# Altium project MSXIV_Front_Power_Distribution.PrjPcb (part 1 of 4)
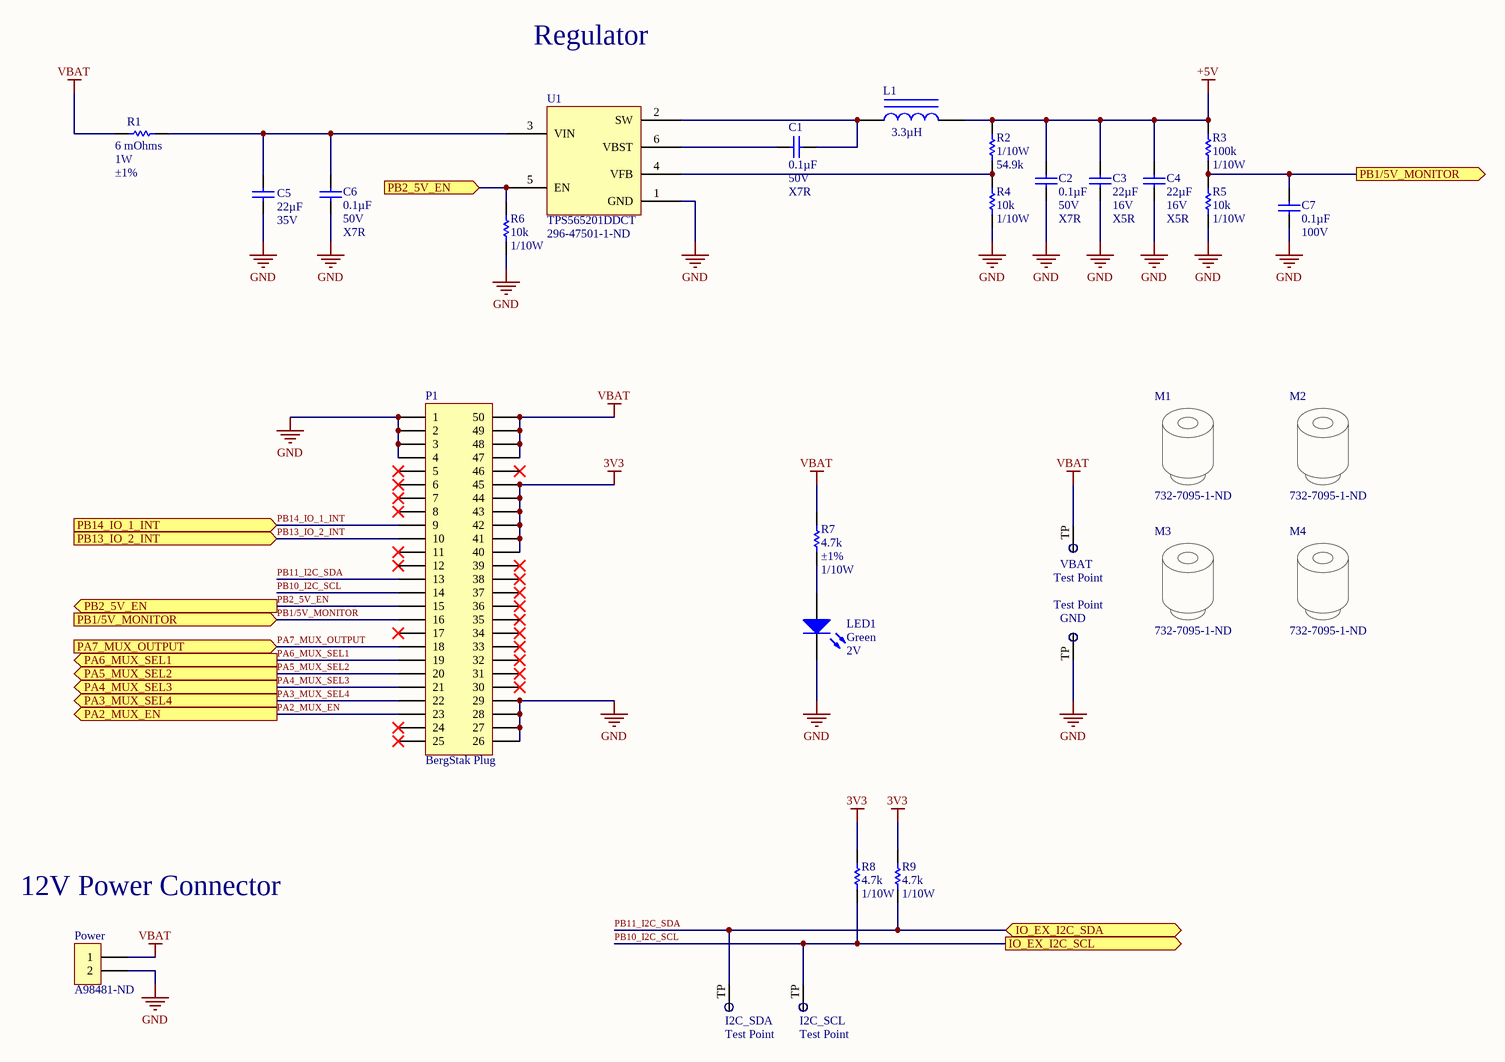
[diagram p0: Controller_Board_Interface.SchDoc]
9 sheets, 277 parts. Net scope: flat (ports and power ports of the same name join across sheets).
Board file: Front Power Distribution.PcbDoc
Sheets:
  Controller_Board_Interface.SchDoc
  Power Distribution - IO Expander.SchDoc
  Power Distribution - Steering, Pedal, Center Console, and Fan.SchDoc
  Power Distribution - Camera.SchDoc
  Power Distribution - Parking Brake Actuator.SchDoc
  Power Distribution - Pi.SchDoc
  Power Distribution - Display.SchDoc
  Power Distribution - Spares.SchDoc
  Power Distribution - Front Lights.SchDoc

## Sheet Controller_Board_Interface.SchDoc: Controller Board Interface
size B; Organization: Midnight Sun Solar Rayce Car Team; Address1: University of Waterloo; Address2: 200 University Ave W; Address3: Waterloo, ON, Canada; Address4: N2L 3E9; Website: www.uwmidsun.com; ProjectName: ProjectName

### Parts
(Parts that share a designator on the sheet are numbered #1, #2 ... from top to bottom, then left to right.)
C1  Capacitance: 0.1µF  Voltage: 50V  Temperature Coefficient: X7R  [CAP, 0603]  (hidden comment: CAP CER 0.1UF 50V 10% X7R 0603)
C2#1  Capacitance: 0.1µF  Voltage: 50V  Temperature Coefficient: X7R  [CAP, 0603]  (hidden comment: CAP CER 0.1UF 50V 10% X7R 0603)
C3  Capacitance: 22µF  Voltage: 16V  Temperature Coefficient: X5R  [CAP, 1210]  (hidden comment: CAP CER 22UF 16V ±20% X5R 1210)
C4  Capacitance: 22µF  Voltage: 16V  Temperature Coefficient: X5R  [CAP, 1210]  (hidden comment: CAP CER 22UF 16V ±20% X5R 1210)
C5  CAP CER 22UF 35V X5R 0805  [CAP, 0805]  (value not drawn)
C6  Capacitance: 0.1µF  Voltage: 50V  Temperature Coefficient: X7R  [CAP, 0603]  (hidden comment: CAP CER 0.1UF 50V 10% X7R 0603)
C7  Capacitance: 0.1µF  Voltage: 100V  [CAP, 0805]  (hidden comment: CAP CER 0.1UF 100V 10% X7R 0805)
GND  Test Point  [Test Point]  (no BOM)
I2C_SCL  Test Point  [Test Point]  (no BOM)
I2C_SDA  Test Point  [Test Point]  (no BOM)
L1  Inductance: 3.3µH  [IND_1264EY-3R3N=P3]  (hidden comment: FIXED IND 3.3UH 6.5A 25.2 MOHM)
LED1  Color: Green  Voltage - Forward (Vf) (Typ): 2V  [LED_0603]  (hidden comment: LED GREEN CLEAR 2V 0603)
M1  Supplier Part Number 1: 732-7095-1-ND  [M2.5 Standoff]  (hidden comment: STANDOFF RND M2.5X0.45 STEEL 5MM)
M2  Supplier Part Number 1: 732-7095-1-ND  [M2.5 Standoff]  (hidden comment: STANDOFF RND M2.5X0.45 STEEL 5MM)
M3  Supplier Part Number 1: 732-7095-1-ND  [M2.5 Standoff]  (hidden comment: STANDOFF RND M2.5X0.45 STEEL 5MM)
M4  Supplier Part Number 1: 732-7095-1-ND  [M2.5 Standoff]  (hidden comment: STANDOFF RND M2.5X0.45 STEEL 5MM)
P1  Series: BergStak Plug  [CONN, Bergstak 50 Pos Plug]  (hidden comment: CONN 50POS Bergstak Plug 0.02")
Power  Supplier Part Number 1: A98481-ND  [6PCV-02-006]  (hidden comment: CONN BARRIER STRIP 2CIRC 0.375")
R1  Resistance: 6 mOhms  Power (Watts): 1W  Tolerance: ±1%  [RES 1206]  (hidden comment: RES 0.006 OHM 1% 1W 1206)
R2  Power (Watts): 1/10W  Resistance (Ohms): 54.9k  [RES, 0603]  (hidden comment: RES 54.9K OHM 1% 1/10W 0603)
R3  Resistance: 100k  Power: 1/10W  [RES, 0603]  (hidden comment: RES 100K OHM 5% 1/8W 0603)
R4  Resistance: 10k  Power: 1/10W  [RES, 0603]  (hidden comment: RES 10K OHM 1% 1/10W 0603)
R5  Resistance: 10k  Power: 1/10W  [RES, 0603]  (hidden comment: RES 10K OHM 1% 1/10W 0603)
R6  Resistance: 10k  Power: 1/10W  [RES, 0603]  (hidden comment: RES 10K OHM 1% 1/10W 0603)
R7  Resistance (Ohms): 4.7k  Tolerance: ±1%  Power (Watts): 1/10W  [RES, 0603]  (hidden comment: RES 4.7K OHM 1% 1/10W 0603)
R8  Resistance (Ohms): 4.7k  Power (Watts): 1/10W  [RES, 0603]  (hidden comment: RES 4.7K OHM 1% 1/10W 0603)
R9  Resistance (Ohms): 4.7k  Power (Watts): 1/10W  [RES, 0603]  (hidden comment: RES 4.7K OHM 1% 1/10W 0603)
U1#1  Manufacturer Part Number: TPS565201DDCT  Supplier Part Number 1: 296-47501-1-ND  [IC REG BUCK 4.5V TO 17V, 5A]  (hidden comment: IC REG BUCK 4.5V TO 17V, 5A, SYNCHRONOUS STE)
VBAT  Test Point  [Test Point]  (no BOM)

### Ports
IO_EX_I2C_SCL (out), IO_EX_I2C_SDA (bidir), PA2_MUX_EN (out), PA3_MUX_SEL4 (out), PA4_MUX_SEL3 (out), PA5_MUX_SEL2 (out), PA6_MUX_SEL1 (out), PA7_MUX_OUTPUT (in), PB1/5V_MONITOR (in), PB1/5V_MONITOR (out), PB2_5V_EN (in), PB2_5V_EN (out), PB13_IO_2_INT (in), PB14_IO_1_INT (in)

### Nets
3V3: P1.40 P1.41 P1.42 P1.43 P1.44 P1.45 R8.1 R9.1
+5V: C2#1.1 C3.1 C4.1 L1.2 R2.1 R3.1
GND: C2#1.2 C3.2 C4.2 C5.2 C6.2 C7.2 GND.TP LED1.2(K) P1.1 P1.2 P1.3 P1.4 P1.26 P1.27 P1.28 P1.29 Power.2 R4.2 R5.2 R6.2 U1#1.1(GND)
VBAT: P1.47 P1.48 P1.49 P1.50 Power.1 R1.1 R7.1 VBAT.TP
PA2_MUX_EN: P1.23 ; port PA2_MUX_EN
PA3_MUX_SEL4: P1.22 ; port PA3_MUX_SEL4
PA4_MUX_SEL3: P1.21 ; port PA4_MUX_SEL3
PA5_MUX_SEL2: P1.20 ; port PA5_MUX_SEL2
PA6_MUX_SEL1: P1.19 ; port PA6_MUX_SEL1
PA7_MUX_OUTPUT: P1.18 ; port PA7_MUX_OUTPUT
PB1/5V_MONITOR: C7.1 P1.16 R3.2 R5.1 ; port PB1/5V_MONITOR
PB2_5V_EN: P1.15 R6.1 U1#1.5(EN) ; port PB2_5V_EN
PB10_I2C_SCL: I2C_SCL.TP P1.14 R8.2 ; port IO_EX_I2C_SCL  [project net IO_EX_I2C_SCL]
PB11_I2C_SDA: I2C_SDA.TP P1.13 R9.2 ; port IO_EX_I2C_SDA  [project net IO_EX_I2C_SDA]
PB13_IO_2_INT: P1.10 ; port PB13_IO_2_INT
PB14_IO_1_INT: P1.9 ; port PB14_IO_1_INT
NetC1_1: C1.1 U1#1.6(VBST)
NetC1_2: C1.2 L1.1 U1#1.2(SW)
NetC5_1: C5.1 C6.1 R1.2 U1#1.3(VIN)
NetLED1_1: LED1.1(A) R7.2
NetR2_2: R2.2 R4.1 U1#1.4(VFB)

Not connected (* = marked no-connect by the designer): P1 5* 6* 7* 8* 11* 12* 17* 24* 25* 30* 31* 32* 33* 34* 35* 36* 37* 38* 39* 46*

### Notes on the sheet
- Regulator
- 12V Power Connector
- PROJECT
- DOCUMENT
- DRAWN BY
- LAST MODIFIED
- PART NUMBER
- REVISION
- SHEET
- VARIANT
- OF
- Engineering 5 - 1002
  University of Waterloo
  (519) 888-4567 x32978
  hardware@uwmidsun.com
- (in symbol CAP CER 22UF 35V X5R 0805) 22µF

### Library data of the parts
C1 C2#1 C6 = CAP CER 0.1UF 50V 10% X7R 0603: 0.10µF ±10% 50V Ceramic Capacitor X7R 0603 (1608 Metric); Manufacturer 1: AVX Corporation; Manufacturer Part Number 1: 06035C104KAT2A; Supplier 1: Digi-Key; Supplier Part Number 1: 478-5052-1-ND; Packaging: Cut Tape (CT); Part Status: Active; Operating Temperature: -55°C ~ 125°C; Ratings: -; Mounting Type: Surface Mount, MLCC; Package / Case: 0603 (1608 Metric); Size / Dimension: 0.063" L x 0.032" W (1.60mm x 0.81mm); Height - Seated (Max): -; Thickness (Max): 0.035" (0.90mm); Lead Spacing: -; Lead Style: -; ComponentLink1URL: http://datasheets.avx.com/X7RDielectric.pdf; ComponentLink1Description: http://datasheets.avx.com/X7RDielectric.pdf; Tolerance: ±10%
C3 C4 = CAP CER 22UF 16V ±20% X5R 1210: 22µF ±20% 16V Ceramic Capacitor X5R 1210 (3225 Metric); Manufacturer 1: Murata Electronics North America; Manufacturer Part Number 1: GRM32ER61C226ME20L; Supplier 1: Digi-Key; Supplier Part Number 1: 490-1881-1-ND; Packaging: Cut Tape (CT); Part Status: Active; Operating Temperature: -55°C ~ 85°C; Ratings: -; Mounting Type: Surface Mount, MLCC; Package / Case: 1210 (3225 Metric); Size / Dimension: 0.126" L x 0.098" W (3.20mm x 2.50mm); Height - Seated (Max): -; Thickness (Max): 0.106" (2.70mm); Lead Spacing: -; Lead Style: -; ComponentLink1URL: http://www.murata.com/~/media/webrenewal/support/library/catalog/products/capacitor/mlcc/c02e.ashx; ComponentLink1Description: http://www.murata.com/~/media/webrenewal/support/library/catalog/products/capacitor/mlcc/c02e.ashx; Tolerance: ±20%
C5 = CAP CER 22UF 35V X5R 0805: 22µF ±20% 35V Ceramic Capacitor X5R 0805 (2012 Metric); Manufacturer: TDK; Manufacturer Part Number: C2012X5R1V226M125AC; Supplier 1: Digi-Key; RoHS: Yes; Stock 1: 30; Pricing 1: 1 = 1.29000, 10 = 0.98100, 100 = 0.70190, 500 = 0.54338, 1000 = 0.46791 (USD); Mount: Surface Mount; Case/Package: 0805; Weight: 0.000194oz; Case Code (Metric): 2012; Case Code (Imperial): 0805; Dielectric Material: Ceramic; Min Operating Temperature: -55°C; Max Operating Temperature: 85°C; Package Quantity: 2000; Packaging: Tape and Reel; Capacitance: 22uF; Tolerance: 20%; Voltage Rating: 35V; Dielectric: X5R; Termination: SMD/SMT; Voltage Rating (DC): 35V; Length: 0.079inch; Height: 1.25mm; Width: 0.049inch; Thickness: 0.057inch; REACH SVHC: No SVHC; Lead Free: Lead Free; ComponentLink1URL: https://product.tdk.com/info/en/catalog/spec/mlccspec_commercial_general_midvoltage_en.pdf; ComponentLink1Description: https://product.tdk.com/info/en/catalog/spec/mlccspec_commercial_general_midvoltage_en.pdf; Supplier Part Number 1: 445-14428-1-ND
C7 = CAP CER 0.1UF 100V 10% X7R 0805: 0.1µF ±10% 100V Ceramic Capacitor X7R 0805 (2012 Metric); Manufacturer 1: Murata Electronics North America; Manufacturer Part Number 1: GCM21BR72A104KA37L; Supplier 1: Digi-Key; Supplier Part Number 1: 490-4789-1-ND; Packaging: Cut Tape (CT); Part Status: Active; Operating Temperature: -55°C ~ 125°C; Ratings: AEC-Q200; Mounting Type: Surface Mount, MLCC; Package / Case: 0805 (2012 Metric); Size / Dimension: 0.079" L x 0.049" W (2.00mm x 1.25mm); Height - Seated (Max): -; Thickness (Max): 0.055" (1.40mm); Lead Spacing: -; Lead Style: -; ComponentLink1URL: http://www.murata.com/~/media/webrenewal/support/library/catalog/products/capacitor/mlcc/c03e.ashx; ComponentLink1Description: http://www.murata.com/~/media/webrenewal/support/library/catalog/products/capacitor/mlcc/c03e.ashx; Tolerance: ±10%; Temperature Coefficient: X7R
L1 = FIXED IND 3.3UH 6.5A 25.2 MOHM: 3.3µH Shielded Wirewound Inductor 6.5A 25.2mOhm Max Nonstandard; Tolerance: ±30%; Inductance Frequency - Test: 100kHz; Material - Core: Ferrite; Supplier 1: Digi-Key; ComponentLink1Description: https://search.murata.co.jp/Ceramy/image/img/P02/J(E)TE243B-0044_DG6050C_reference.pdf; ComponentLink1URL: https://search.murata.co.jp/Ceramy/image/img/P02/J(E)TE243B-0044_DG6050C_reference.pdf; Type: Wirewound; Current Rating (Amps): 6.5A; Shielding: Shielded; DC Resistance (DCR): 25.2mOhm Max; Supplier Part Number 1: 490-10821-1-ND
LED1 = LED GREEN CLEAR 2V 0603: Green 572nm LED Indication - Discrete 2V 0603 (1608 Metric); Manufacturer: Wurth Electronics Inc.; Manufacturer Part Number: 150060VS75000; Lens Color: Colorless; Millicandela Rating: 40mcd; Lens Style/Size: Rectangle with Flat Top, 1.10mm x 0.70mm; Current - Test: 20mA; Viewing Angle: 140°; Wavelength - Dominant: 570nm; Supplier 1: Digi-Key; Supplier Part Number 1: 732-4980-1-ND; Packaging: Cut Tape (CT); Part Status: Active; Lens Transparency: Clear; Mounting Type: Surface Mount; Wavelength - Peak: 572nm; Package / Case: 0603 (1608 Metric); Supplier Device Package: 0603; Size / Dimension: 1.60mm L x 0.80mm W; Height (Max): 0.80mm; ComponentLink1URL: http://katalog.we-online.de/led/datasheet/150060VS75000.pdf; ComponentLink1Description: http://katalog.we-online.de/led/datasheet/150060VS75000.pdf; Category: Optoelectronics; Features: -; Pricing 1: 1=0.21, 100=0.1617, 500=0.13964 (CAD); RoHS: RoHS Compliant; Stock 1: 9408
M1-M4 = STANDOFF RND M2.5X0.45 STEEL 5MM: Manufacturer: Wurth Electronics; Manufacturer Part Number: 9774050151R; Plating: Tin; Threaded/Unthreaded: Threaded; Outside Diameter: 0.201inch; Supplier 1: Digi-Key; RoHS: Yes; Stock 1: 24846; Pricing 1: 1 = 1.09000, 10 = 1.03000, 50 = 0.91800, 100 = 0.84000 (USD); Material: Steel; Length: 0.252inch; REACH SVHC: Unknown
P1 = CONN 50POS Bergstak Plug 0.02": 50 Position Connector Plug, Outer Shroud Contacts Surface Mount Gold; Manufacturer 1: Amphenol FCI; Manufacturer Part Number 1: 10132797-055100LF; Number of Positions: 50; Mated Stacking Heights: 5mm; Pitch: 0.020" (0.50mm); Supplier 1: Digi-Key; Supplier Part Number 1: 609-5226-1-ND; Packaging: Cut Tape (CT); Part Status: Active; Connector Type: Plug, Outer Shroud Contacts; Number of Rows: 2; Mounting Type: Surface Mount; Contact Finish: Gold; Contact Finish Thickness: 1µin (0.025µm); Height Above Board: 0.169" (4.30mm); ComponentLink1URL: http://portal.fciconnect.com/Comergent//fci/drawing/10132797.pdf; ComponentLink1Description: http://portal.fciconnect.com/Comergent//fci/drawing/10132797.pdf
Power = CONN BARRIER STRIP 2CIRC 0.375": 2 Circuit 0.375" (9.53mm) Barrier Block Connector, Screws; ComponentLink1Description: https://www.te.com/commerce/DocumentDelivery/DDEController?Action=srchrtrv&DocNm=3-1437652-9&DocType=Customer+Drawing&DocLang=English; ComponentLink1URL: https://www.te.com/commerce/DocumentDelivery/DDEController?Action=srchrtrv&DocNm=3-1437652-9&DocType=Customer+Drawing&DocLang=English; Supplier 1: Digi-Key
R1 = RES 0.006 OHM 1% 1W 1206: 6 mOhms ±1% 1W Chip Resistor 1206 (3216 Metric) Automotive AEC-Q200, Current Sense Thick Film; ComponentLink1Description: https://d1d2qsbl8m0m72.cloudfront.net/en/products/databook/datasheet/passive/resistor/chip_resistor/pmr-e.pdf; ComponentLink1URL: https://d1d2qsbl8m0m72.cloudfront.net/en/products/databook/datasheet/passive/resistor/chip_resistor/pmr-e.pdf; Supplier 1: Digi-Key; Composition: Thick Film; Supplier Device Package: 1206; Ratings: AEC-Q200; Operating Temperature: -55°C ~ 155°C; Packaging: Cut Tape (CT); Series: PMR; Supplier Part Number 1: RHM.006ALCT-ND
R2 = RES 54.9K OHM 1% 1/10W 0603: 54.9k Ohm ±1% 0.1W, 1/10W Chip Resistor 0603 (1608 Metric) Automotive AEC-Q200 Thick Film; Manufacturer: Panasonic Electronic Components; Manufacturer Part Number: ERJ-3EKF5492V; Temperature Coefficient: ±100ppm/°C; Supplier 1: Digi-Key; RoHS: RoHS Compliant; Category: Resistors; Stock 1: 74038; Pricing 1: 1=0.16, 10=0.031, 100=0.0127, 1000=0.00567, 2500=0.00492 (CAD); Packaging: Cut Tape (CT); Part Status: Active; Composition: Thick Film; Features: Automotive AEC-Q200; Operating Temperature: -55°C ~ 155°C; Package / Case: 0603 (1608 Metric); Supplier Device Package: 0603; Size / Dimension: 0.063" L x 0.031" W (1.60mm x 0.80mm); Height - Seated (Max): 0.022" (0.55mm); Failure Rate: -; ComponentLink1URL: https://industrial.panasonic.com/cdbs/www-data/pdf/RDA0000/AOA0000C298.pdf; ComponentLink1Description: https://industrial.panasonic.com/cdbs/www-data/pdf/RDA0000/AOA0000C298.pdf; Supplier Part Number 1: P54.9KHCT-ND; Tolerance: ±1%
R3 = RES 100K OHM 5% 1/8W 0603: RES SMD 100K OHM 5% 1/10W 0603; Manufacturer 1: Yageo; Manufacturer Part Number 1: RC0603JR-07100KL; Temperature Coefficient: ±100ppm/°C; Supplier 1: Digi-Key; Supplier Part Number 1: 311-100KGRCT-ND; Packaging: Cut Tape (CT); Part Status: Active; Composition: Thick Film; Operating Temperature: -55°C ~ 155°C; Package / Case: 0603 (1608 Metric); Supplier Device Package: 0603; Size / Dimension: 0.063" L x 0.031" W (1.60mm x 0.80mm); Height - Seated (Max): 0.022" (0.55mm); Failure Rate: -; ComponentLink1URL: http://www.yageo.com/documents/recent/PYu-RC_Group_51_RoHS_L_7.pdf; ComponentLink1Description: http://www.yageo.com/documents/recent/PYu-RC_Group_51_RoHS_L_7.pdf; Tolerance: ±5%
R4-R6 = RES 10K OHM 1% 1/10W 0603: RES SMD 10K OHM 1% 1/10W 0603; Manufacturer 1: Yageo; Manufacturer Part Number 1: RC0603FR-0710KL; Temperature Coefficient: ±100ppm/°C; Supplier 1: Digi-Key; Supplier Part Number 1: 311-10.0KHRCT-ND; Packaging: Cut Tape (CT); Part Status: Active; Composition: Thick Film; Operating Temperature: -55°C ~ 155°C; Package / Case: 0603 (1608 Metric); Supplier Device Package: 0603; Size / Dimension: 0.063" L x 0.031" W (1.60mm x 0.80mm); Height - Seated (Max): 0.022" (0.55mm); Failure Rate: -; ComponentLink1URL: http://www.yageo.com/documents/recent/PYu-RC_Group_51_RoHS_L_7.pdf; ComponentLink1Description: http://www.yageo.com/documents/recent/PYu-RC_Group_51_RoHS_L_7.pdf; Tolerance: ±1%
R7-R9 = RES 4.7K OHM 1% 1/10W 0603: 4.7k Ohm ±1% 0.1W, 1/10W Chip Resistor 0603 (1608 Metric) Moisture Resistant Thick Film; Manufacturer 1: Yageo; Manufacturer Part Number 1: RC0603FR-074K7L; Description 1: RES SMD 4.7K OHM 1% 1/10W 0603; Temperature Coefficient: ±100ppm/°C; Supplier 1: Digi-Key; Supplier Part Number 1: 311-4.70KHRCT-ND; RoHS: RoHS Compliant; Category: Resistors; Stock 1: 3487566; Pricing 1: 1=0.16, 10=0.022, 100=0.0089, 1000=0.00402, 2500=0.00349 (CAD); Packaging: Cut Tape (CT); Part Status: Active; Composition: Thick Film; Features: Moisture Resistant; Operating Temperature: -55°C ~ 155°C; Package / Case: 0603 (1608 Metric); Supplier Device Package: 0603; Size / Dimension: 0.063" L x 0.031" W (1.60mm x 0.80mm); Height - Seated (Max): 0.022" (0.55mm); Failure Rate: -; ComponentLink1URL: http://www.yageo.com/documents/recent/PYu-RC_Group_51_RoHS_L_7.pdf; ComponentLink1Description: http://www.yageo.com/documents/recent/PYu-RC_Group_51_RoHS_L_7.pdf
  R8 R9: Tolerance: ±1%
U1#1 = IC REG BUCK 4.5V TO 17V, 5A, SYNCHRONOUS STE: Buck Switching Regulator IC Positive Adjustable 0.6V 1 Output 5A SOT-23-6 Thin, TSOT-23-6; Manufacturer: Texas Instruments; Supplier 1: Digi-Key; Stock 1: 2226; Pricing 1: 1 = 2.46000, 10 = 2.21100, 100 = 1.77710 (USD); Min Operating Temperature: -40°C; Max Operating Temperature: 125°C

## Sheet Power Distribution - IO Expander.SchDoc: Title
size B; Organization: Midnight Sun Solar Rayce Car Team; Address1: University of Waterloo; Address2: 200 University Ave W; Address3: Waterloo, ON, Canada; Address4: N2L 3E9; Website: www.uwmidsun.com; ProjectName: ProjectName
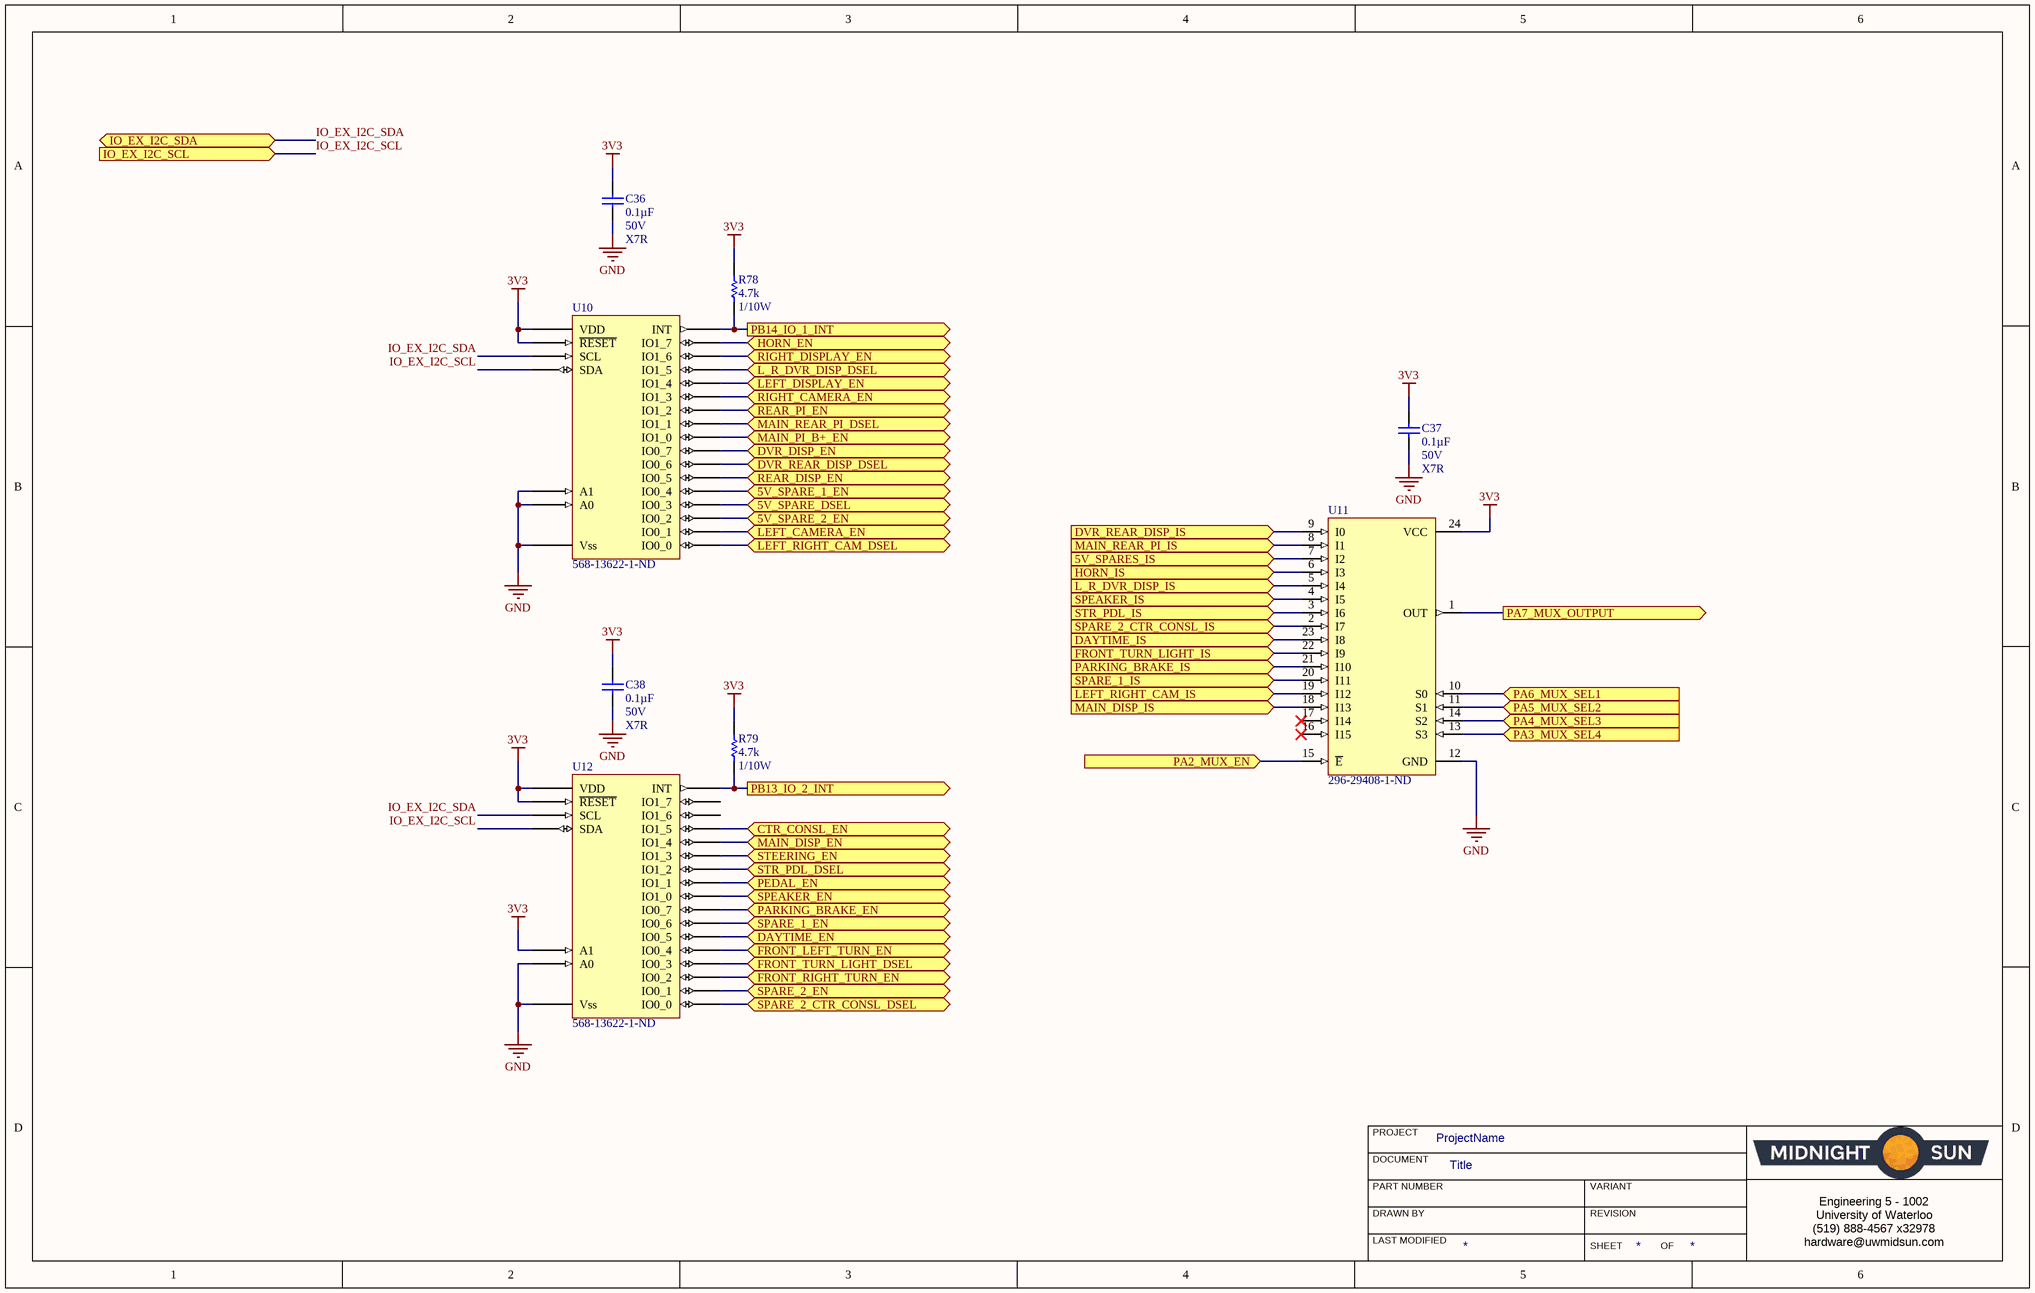
[diagram p1: Power Distribution - IO Expander.SchDoc]

### Parts
(Parts that share a designator on the sheet are numbered #1, #2 ... from top to bottom, then left to right.)
C36  Capacitance: 0.1µF  Voltage: 50V  Temperature Coefficient: X7R  [CAP, 0603]  (hidden comment: CAP CER 0.1UF 50V 10% X7R 0603)
C37  Capacitance: 0.1µF  Voltage: 50V  Temperature Coefficient: X7R  [CAP, 0603]  (hidden comment: CAP CER 0.1UF 50V 10% X7R 0603)
C38  Capacitance: 0.1µF  Voltage: 50V  Temperature Coefficient: X7R  [CAP, 0603]  (hidden comment: CAP CER 0.1UF 50V 10% X7R 0603)
R78  Resistance (Ohms): 4.7k  Power (Watts): 1/10W  [RES, 0603]  (hidden comment: RES 4.7K OHM 1% 1/10W 0603)
R79  Resistance (Ohms): 4.7k  Power (Watts): 1/10W  [RES, 0603]  (hidden comment: RES 4.7K OHM 1% 1/10W 0603)
U10  Supplier Part Number 1: 568-13622-1-ND  [SOP127P600-8N]  (hidden comment: 16-BIT I2C-BUS AND SMBUS LOW POW)
U11  Supplier Part Number 1: 296-29408-1-ND  [SOP127P1030X265-24N]  (hidden comment: IC MUX/DEMUX 1X16 24SSOP)
U12#1  Supplier Part Number 1: 568-13622-1-ND  [SOP127P600-8N]  (hidden comment: 16-BIT I2C-BUS AND SMBUS LOW POW)

### Ports
5V_SPARE_1_EN (bidir), 5V_SPARE_2_EN (bidir), 5V_SPARE_DSEL (bidir), 5V_SPARES_IS (in), CTR_CONSL_EN (bidir), DAYTIME_EN (bidir), DAYTIME_IS (in), DVR_DISP_EN (bidir), DVR_REAR_DISP_DSEL (bidir), DVR_REAR_DISP_IS (in), FRONT_LEFT_TURN_EN (bidir), FRONT_RIGHT_TURN_EN (bidir), FRONT_TURN_LIGHT_DSEL (bidir), FRONT_TURN_LIGHT_IS (in), HORN_EN (bidir), HORN_IS (in), IO_EX_I2C_SCL (in), IO_EX_I2C_SDA (bidir), L_R_DVR_DISP_DSEL (bidir), L_R_DVR_DISP_IS (in), LEFT_CAMERA_EN (bidir), LEFT_DISPLAY_EN (bidir), LEFT_RIGHT_CAM_DSEL (bidir), LEFT_RIGHT_CAM_IS (in), MAIN_DISP_EN (bidir), MAIN_DISP_IS (in), MAIN_PI_B+_EN (bidir), MAIN_REAR_PI_DSEL (bidir), MAIN_REAR_PI_IS (in), PA2_MUX_EN (in), PA3_MUX_SEL4 (in), PA4_MUX_SEL3 (in), PA5_MUX_SEL2 (in), PA6_MUX_SEL1 (in), PA7_MUX_OUTPUT (out), PARKING_BRAKE_EN (bidir), PARKING_BRAKE_IS (in), PB13_IO_2_INT (out), PB14_IO_1_INT (out), PEDAL_EN (bidir), REAR_DISP_EN (bidir), REAR_PI_EN (bidir), RIGHT_CAMERA_EN (bidir), RIGHT_DISPLAY_EN (bidir), SPARE_1_EN (bidir), SPARE_1_IS (in), SPARE_2_CTR_CONSL_DSEL (bidir), SPARE_2_CTR_CONSL_IS (in), SPARE_2_EN (bidir), SPEAKER_EN (bidir), SPEAKER_IS (in), STEERING_EN (bidir), STR_PDL_DSEL (bidir), STR_PDL_IS (in)

### Nets
3V3: C36.1 C37.1 C38.1 R78.1 R79.1 U10.3(~{RESET}) U10.24(VDD) U11.24(VCC) U12#1.2(A1) U12#1.3(~{RESET}) U12#1.24(VDD)
GND: C36.2 C37.2 C38.2 U10.2(A1) U10.12(Vss) U10.21(A0) U11.12(GND) U12#1.12(Vss) U12#1.21(A0)
IO_EX_I2C_SCL: U10.23(SDA) U12#1.23(SDA) ; port IO_EX_I2C_SCL
IO_EX_I2C_SDA: U10.22(SCL) U12#1.22(SCL) ; port IO_EX_I2C_SDA
PA2_MUX_EN: U11.15(~{E}) ; port PA2_MUX_EN
PA3_MUX_SEL4: U11.13(S3) ; port PA3_MUX_SEL4
PA4_MUX_SEL3: U11.14(S2) ; port PA4_MUX_SEL3
PA5_MUX_SEL2: U11.11(S1) ; port PA5_MUX_SEL2
PA6_MUX_SEL1: U11.10(S0) ; port PA6_MUX_SEL1
PA7_MUX_OUTPUT: U11.1(OUT) ; port PA7_MUX_OUTPUT
PB13_IO_2_INT: R79.2 U12#1.1(INT) ; port PB13_IO_2_INT
PB14_IO_1_INT: R78.2 U10.1(INT) ; port PB14_IO_1_INT
NetC2#2_1: U11.6(I3) ; port HORN_IS
NetC9_1: U11.22(I9) ; port FRONT_TURN_LIGHT_IS
NetC14#2_1: U11.23(I8) ; port DAYTIME_IS
NetC16_1: U11.3(I6) ; port STR_PDL_IS
NetC30#2_1: U11.18(I13) ; port MAIN_DISP_IS
NetC31#1_1: U11.4(I5) ; port SPEAKER_IS
NetC31#2_1: U11.9(I0) ; port DVR_REAR_DISP_IS
NetC35_1: U11.5(I4) ; port L_R_DVR_DISP_IS
NetC42_1: U11.8(I1) ; port MAIN_REAR_PI_IS
NetC46_1: U11.7(I2) ; port 5V_SPARES_IS
NetC51_1: U11.20(I11) ; port SPARE_1_IS
NetC56_1: U11.19(I12) ; port LEFT_RIGHT_CAM_IS
NetC60_1: U11.21(I10) ; port PARKING_BRAKE_IS
NetR10_1: U12#1.8(IO0_4) ; port FRONT_LEFT_TURN_EN
NetR10_3: U12#1.7(IO0_3) ; port FRONT_TURN_LIGHT_DSEL
NetR10_4: U12#1.6(IO0_2) ; port FRONT_RIGHT_TURN_EN
NetR19_1: U12#1.9(IO0_5) ; port DAYTIME_EN
NetR23#1_1: U12#1.14(IO1_1) ; port PEDAL_EN
NetR23#1_3: U12#1.15(IO1_2) ; port STR_PDL_DSEL
NetR23#1_4: U12#1.16(IO1_3) ; port STEERING_EN
NetR38_1: U10.20(IO1_7) ; port HORN_EN
NetR39_1: U10.5(IO0_1) ; port LEFT_CAMERA_EN
NetR39_3: U10.4(IO0_0) ; port LEFT_RIGHT_CAM_DSEL
NetR39_4: U10.16(IO1_3) ; port RIGHT_CAMERA_EN
NetR55#2_1: U10.11(IO0_7) ; port DVR_DISP_EN
NetR55#2_3: U10.10(IO0_6) ; port DVR_REAR_DISP_DSEL
NetR55#2_4: U10.9(IO0_5) ; port REAR_DISP_EN
NetR56#1_1: U12#1.13(IO1_0) ; port SPEAKER_EN
NetR57#2_1: U12#1.17(IO1_4) ; port MAIN_DISP_EN
NetR69_1: U10.17(IO1_4) ; port LEFT_DISPLAY_EN
NetR69_3: U10.18(IO1_5) ; port L_R_DVR_DISP_DSEL
NetR69_4: U10.19(IO1_6) ; port RIGHT_DISPLAY_EN
NetR80_1: U10.13(IO1_0) ; port MAIN_PI_B+_EN
NetR80_3: U10.14(IO1_1) ; port MAIN_REAR_PI_DSEL
NetR80_4: U10.15(IO1_2) ; port REAR_PI_EN
NetR89_1: U10.8(IO0_4) ; port 5V_SPARE_1_EN
NetR89_3: U10.7(IO0_3) ; port 5V_SPARE_DSEL
NetR89_4: U10.6(IO0_2) ; port 5V_SPARE_2_EN
NetR102_1: U12#1.5(IO0_1) ; port SPARE_2_EN
NetR103_1: U12#1.10(IO0_6) ; port SPARE_1_EN
NetR127_1: U12#1.11(IO0_7) ; port PARKING_BRAKE_EN
NetU11_2: U11.2(I7) ; port SPARE_2_CTR_CONSL_IS
NetU12#1_4: U12#1.4(IO0_0) ; port SPARE_2_CTR_CONSL_DSEL
NetU12#1_18: U12#1.18(IO1_5) ; port CTR_CONSL_EN

Not connected (* = marked no-connect by the designer): U11 16(I15)* 17(I14)*; U12#1 19(IO1_6) 20(IO1_7)

### Notes on the sheet
- PROJECT
- DOCUMENT
- DRAWN BY
- LAST MODIFIED
- PART NUMBER
- REVISION
- SHEET
- VARIANT
- OF
- Engineering 5 - 1002
  University of Waterloo
  (519) 888-4567 x32978
  hardware@uwmidsun.com

### Library data of the parts
C36-C38 = CAP CER 0.1UF 50V 10% X7R 0603: as C1 on sheet Controller_Board_Interface; Supplier 1: Digi-Key; Supplier Part Number 1: 478-5052-1-ND; Packaging: Cut Tape (CT); Part Status: Active; Operating Temperature: -55°C ~ 125°C; Ratings: -; Mounting Type: Surface Mount, MLCC; Package / Case: 0603 (1608 Metric); Size / Dimension: 0.063" L x 0.032" W (1.60mm x 0.81mm); Height - Seated (Max): -; Thickness (Max): 0.035" (0.90mm); Lead Spacing: -; Lead Style: -; ComponentLink1URL: http://datasheets.avx.com/X7RDielectric.pdf; ComponentLink1Description: http://datasheets.avx.com/X7RDielectric.pdf; Tolerance: ±10%
R78 R79 = RES 4.7K OHM 1% 1/10W 0603: as R7 on sheet Controller_Board_Interface; Supplier 1: Digi-Key; Supplier Part Number 1: 311-4.70KHRCT-ND; RoHS: RoHS Compliant; Category: Resistors; Stock 1: 3487566; Pricing 1: 1=0.16, 10=0.022, 100=0.0089, 1000=0.00402, 2500=0.00349 (CAD); Packaging: Cut Tape (CT); Part Status: Active; Composition: Thick Film; Features: Moisture Resistant; Operating Temperature: -55°C ~ 155°C; Package / Case: 0603 (1608 Metric); Supplier Device Package: 0603; Size / Dimension: 0.063" L x 0.031" W (1.60mm x 0.80mm); Height - Seated (Max): 0.022" (0.55mm); Failure Rate: -; ComponentLink1URL: http://www.yageo.com/documents/recent/PYu-RC_Group_51_RoHS_L_7.pdf; ComponentLink1Description: http://www.yageo.com/documents/recent/PYu-RC_Group_51_RoHS_L_7.pdf; Tolerance: ±1%
U10 U12#1 = 16-BIT I2C-BUS AND SMBUS LOW POW: I/O Expander 16 I²C, SMBus 400kHz 24-TSSOP; ComponentLink1Description: https://www.nxp.com/docs/en/data-sheet/PCA9539_PCA9539R.pdf; ComponentLink1URL: https://www.nxp.com/docs/en/data-sheet/PCA9539_PCA9539R.pdf; Supplier 1: Digi-Key
U11 = IC MUX/DEMUX 1X16 24SSOP: 1 Circuit IC Switch 16:1 160 Ohm 24-SOIC; Manufacturer: Texas Instruments; Manufacturer Part Number: CD74HC4067M96; Number of Channels: 1; Number of Inputs: 16; Max Supply Voltage: 6V; Min Supply Voltage: 2V; Bandwidth: 89MHz; Propagation Delay: 75ns; On-State Resistance: 180R; Turn-On Delay Time: 300ns; Turn-Off Delay Time: 290ns; Logic Function: Demultiplexer,Multiplexer; Operating Supply Current: 8uA; Supply Type: Single; Low Level Output Current: 25mA; ComponentLink1URL: http://www.ti.com/lit/ds/symlink/cd74hc4067.pdf; ComponentLink1Description: http://www.ti.com/lit/ds/symlink/cd74hc4067.pdf; Supplier 1: Digi-Key; Stock 1: 10305; Pricing 1: 1 = 0.80000, 10 = 0.70400, 100 = 0.53940, 500 = 0.42642, 1000 = 0.34114 (USD); RoHS: Yes; Mount: Surface Mount; Case/Package: SOIC; Number of Pins: 24; Weight: 0.022025oz; Contact Plating: Matte,Tin; Min Operating Temperature: -55°C; Max Operating Temperature: 125°C; Number of Outputs: 1; Packaging: Tape and Reel; Package Quantity: 2000; Number of Circuits: 1; Nominal Supply Current: 8uA; Number of Bits: 16; High Level Output Current: 25mA; Length: 15.4mm; Height: 2.35mm; Width: 7.52mm; Radiation Hardening: No; REACH SVHC: No SVHC; Lead Free: Lead Free; ComponentLink2URL: https://www.verical.com/server-webapp/html/getDatasheet?partID=322813&src-supplier=Verical; ComponentLink2Description: https://www.verical.com/server-webapp/html/getDatasheet?partID=322813&src-supplier=Verical; ComponentLink3URL: http://focus.ti.com/lit/ds/symlink/cd74hc4067.pdf?src-supplier=Avnet+Europe; ComponentLink3Description: http://focus.ti.com/lit/ds/symlink/cd74hc4067.pdf?src-supplier=Avnet+Europe; ComponentLink4URL: http://www.ti.com/lit/ds/symlink/cd74hc4067.pdf?src-supplier=Digi-Key; ComponentLink4Description: http://www.ti.com/lit/ds/symlink/cd74hc4067.pdf?src-supplier=Digi-Key

## Sheet Power Distribution - Steering, Pedal, Center Console, and Fan.SchDoc: Title
size B; Organization: Midnight Sun Solar Rayce Car Team; Address1: University of Waterloo; Address2: 200 University Ave W; Address3: Waterloo, ON, Canada; Address4: N2L 3E9; Website: www.uwmidsun.com; ProjectName: ProjectName
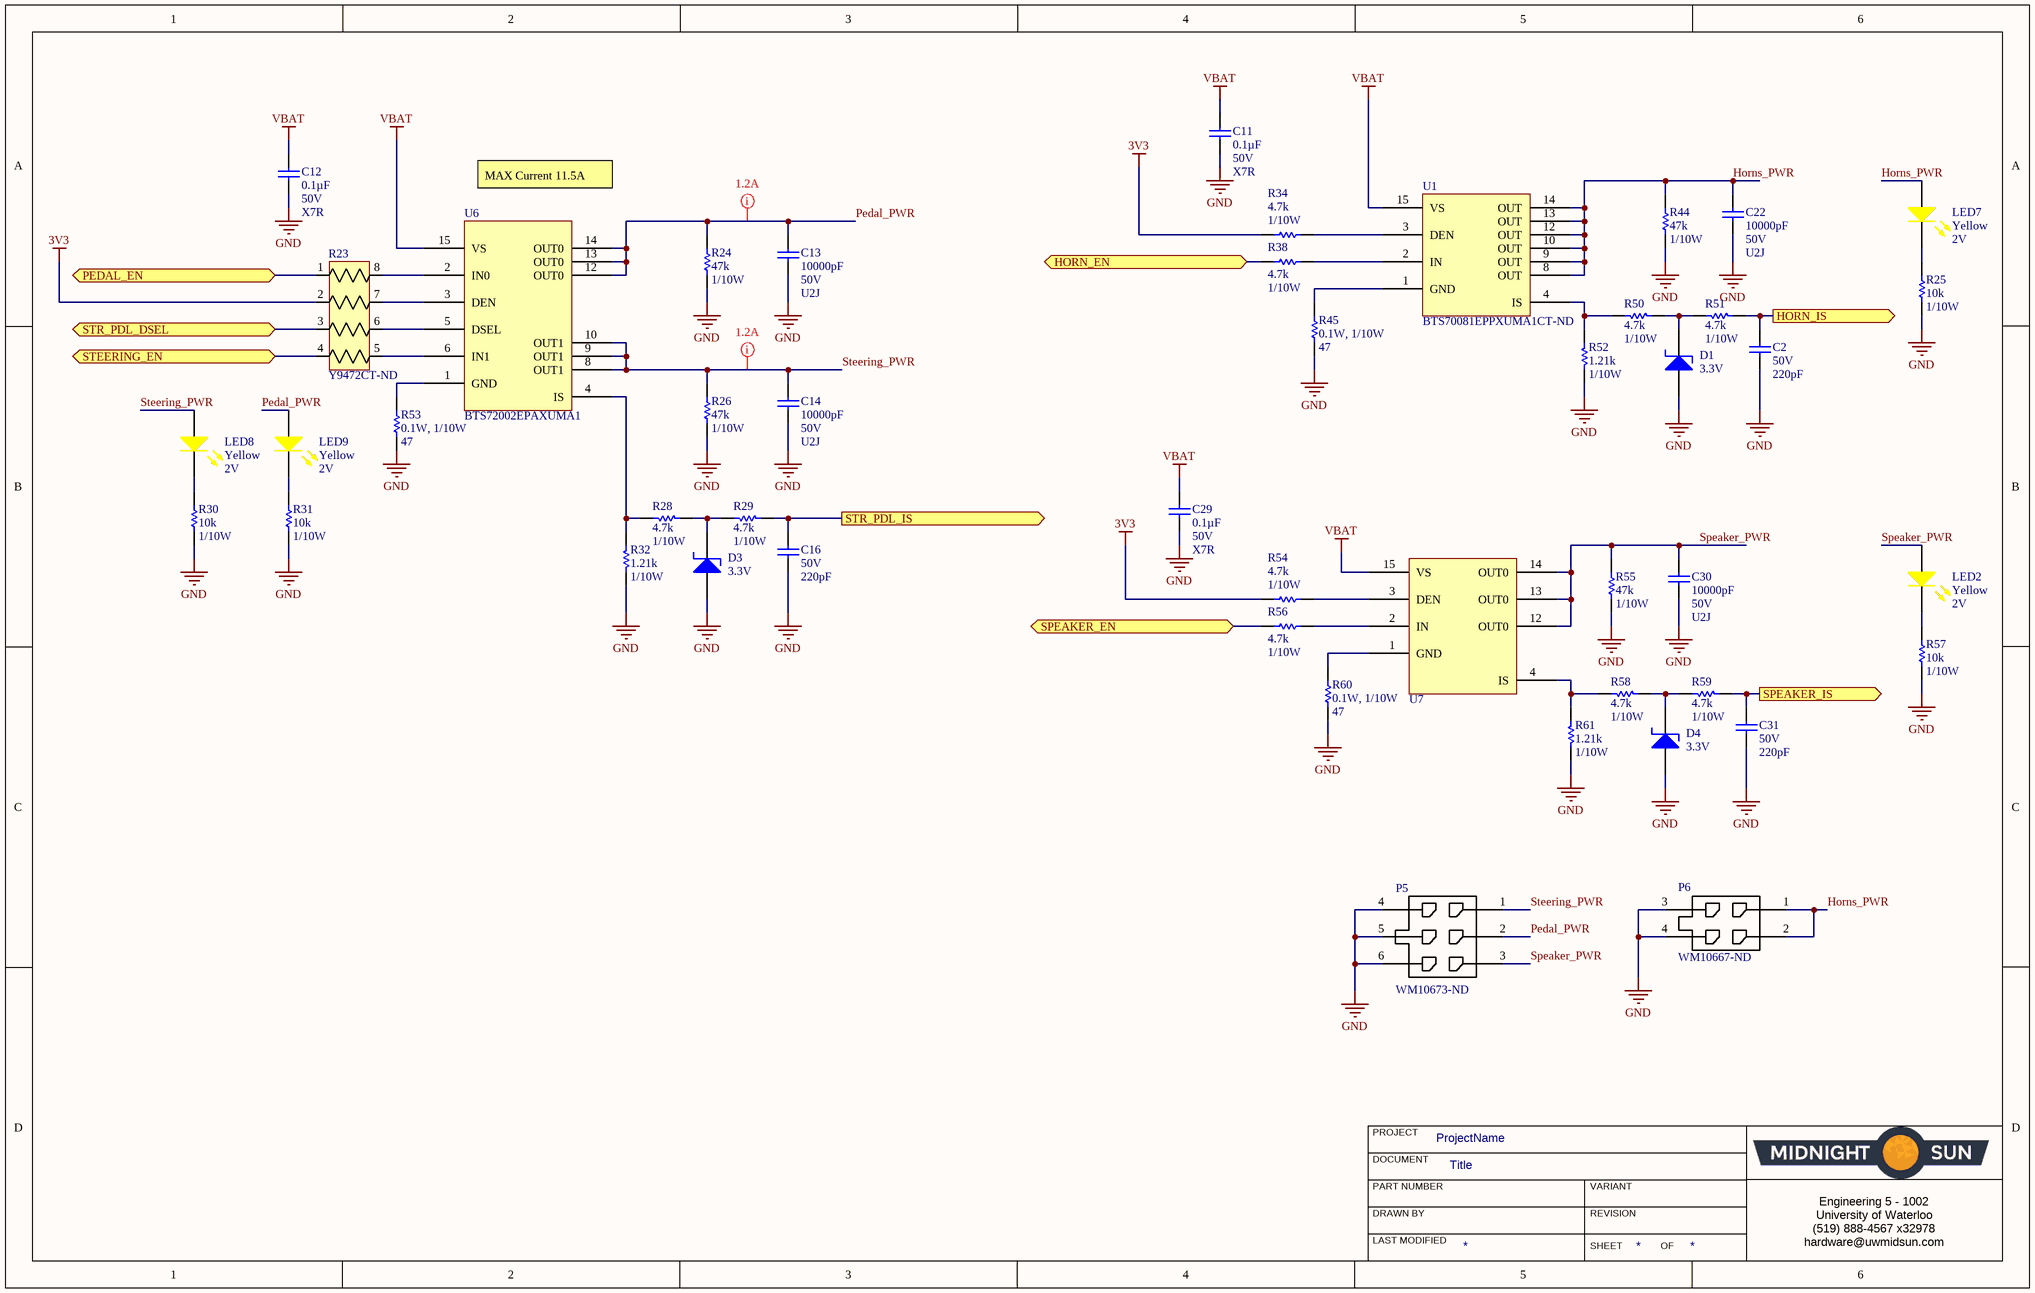
[diagram p2: Power Distribution - Steering, Pedal, Center Console, and Fan.SchDoc]

### Parts
(Parts that share a designator on the sheet are numbered #1, #2 ... from top to bottom, then left to right.)
C2#2  Voltage Rating: 50V  Capacitance: 220pF  [CAP, 0603]  (hidden comment: CAP CER 220PF 50V C0G/NP0 0603)
C11#1  Capacitance: 0.1µF  Voltage: 50V  Temperature Coefficient: X7R  [CAP, 0603]  (hidden comment: CAP CER 0.1UF 50V 10% X7R 0603)
C12#1  Capacitance: 0.1µF  Voltage: 50V  Temperature Coefficient: X7R  [CAP, 0603]  (hidden comment: CAP CER 0.1UF 50V 10% X7R 0603)
C13#1  Capacitance: 10000pF  Voltage: 50V  Temperature Coefficient: U2J  [CAP, 0603]  (hidden comment: CAP CER 10nF 50V 5% X7R 0603)
C14#1  Capacitance: 10000pF  Voltage: 50V  Temperature Coefficient: U2J  [CAP, 0603]  (hidden comment: CAP CER 10nF 50V 5% X7R 0603)
C16  Voltage Rating: 50V  Capacitance: 220pF  [CAP, 0603]  (hidden comment: CAP CER 220PF 50V C0G/NP0 0603)
C22  Capacitance: 10000pF  Voltage: 50V  Temperature Coefficient: U2J  [CAP, 0603]  (hidden comment: CAP CER 10nF 50V 5% X7R 0603)
C29#1  Capacitance: 0.1µF  Voltage: 50V  Temperature Coefficient: X7R  [CAP, 0603]  (hidden comment: CAP CER 0.1UF 50V 10% X7R 0603)
C30#1  Capacitance: 10000pF  Voltage: 50V  Temperature Coefficient: U2J  [CAP, 0603]  (hidden comment: CAP CER 10nF 50V 5% X7R 0603)
C31#1  Voltage Rating: 50V  Capacitance: 220pF  [CAP, 0603]  (hidden comment: CAP CER 220PF 50V C0G/NP0 0603)
D1#1  Voltage: 3.3V  [sod-323]  (hidden comment: DIODE ZENER 3.3V 200MW SOD323)
D3  Voltage: 3.3V  [sod-323]  (hidden comment: DIODE ZENER 3.3V 200MW SOD323)
D4  Voltage: 3.3V  [sod-323]  (hidden comment: DIODE ZENER 3.3V 200MW SOD323)
LED2#1  Color: Yellow  Voltage - Forward (Vf) (Typ): 2V  [LED_0603]  (hidden comment: LED YELLOW CLEAR 2.1V 0603)
LED7  Color: Yellow  Voltage - Forward (Vf) (Typ): 2V  [LED_0603]  (hidden comment: LED YELLOW CLEAR 2.1V 0603)
LED8  Color: Yellow  Voltage - Forward (Vf) (Typ): 2V  [LED_0603]  (hidden comment: LED YELLOW CLEAR 2.1V 0603)
LED9#1  Color: Yellow  Voltage - Forward (Vf) (Typ): 2V  [LED_0603]  (hidden comment: LED YELLOW CLEAR 2.1V 0603)
P5  Supplier Part Number 1: WM10673-ND  [CONN, 6POS MICRO-FIT 3MM]  (hidden comment: CONN 6POS MICRO-FIT 3mm)
P6  Supplier Part Number 1: WM10667-ND  [CONN 4POS MICROFIT (2x2)]  (hidden comment: CONN 4POS MICRO-FIT 3mm)
R23#1  Supplier Part Number 1: Y9472CT-ND  [RES ARRAY 4RES 1206]  (hidden comment: RES ARRAY 4 RES 4.7K OHM 1206)
R24#1  Resistance: 47k  Power Rating: 1/10W  [RES, 0603]  (hidden comment: RES 47K OHM 1% 1/10W 0603)
R25#1  Resistance: 10k  Power: 1/10W  [RES, 0603]  (hidden comment: RES 10K OHM 1% 1/10W 0603)
R26#1  Resistance: 47k  Power Rating: 1/10W  [RES, 0603]  (hidden comment: RES 47K OHM 1% 1/10W 0603)
R28  Resistance (Ohms): 4.7k  Power (Watts): 1/10W  [RES, 0603]  (hidden comment: RES 4.7K OHM 1% 1/10W 0603)
R29  Resistance (Ohms): 4.7k  Power (Watts): 1/10W  [RES, 0603]  (hidden comment: RES 4.7K OHM 1% 1/10W 0603)
R30  Resistance: 10k  Power: 1/10W  [RES, 0603]  (hidden comment: RES 10K OHM 1% 1/10W 0603)
R31  Resistance: 10k  Power: 1/10W  [RES, 0603]  (hidden comment: RES 10K OHM 1% 1/10W 0603)
R32  Resistance: 1.21k  Power: 1/10W  [RES, 0603]  (hidden comment: RES 1.21K OHM 1% 1/10W 0603)
R34  Resistance (Ohms): 4.7k  Power (Watts): 1/10W  [RES, 0603]  (hidden comment: RES 4.7K OHM 1% 1/10W 0603)
R38  Resistance (Ohms): 4.7k  Power (Watts): 1/10W  [RES, 0603]  (hidden comment: RES 4.7K OHM 1% 1/10W 0603)
R44  Resistance: 47k  Power Rating: 1/10W  [RES, 0603]  (hidden comment: RES 47K OHM 1% 1/10W 0603)
R45  Power (Watts): 0.1W, 1/10W  Values: 47  [RES, 0603]  (hidden comment: RES SMD 47 OHM 1% 1/10W 0603)
R50  Resistance (Ohms): 4.7k  Power (Watts): 1/10W  [RES, 0603]  (hidden comment: RES 4.7K OHM 1% 1/10W 0603)
R51  Resistance (Ohms): 4.7k  Power (Watts): 1/10W  [RES, 0603]  (hidden comment: RES 4.7K OHM 1% 1/10W 0603)
R52#1  Resistance: 1.21k  Power: 1/10W  [RES, 0603]  (hidden comment: RES 1.21K OHM 1% 1/10W 0603)
R53#1  Power (Watts): 0.1W, 1/10W  Values: 47  [RES, 0603]  (hidden comment: RES SMD 47 OHM 1% 1/10W 0603)
R54#1  Resistance (Ohms): 4.7k  Power (Watts): 1/10W  [RES, 0603]  (hidden comment: RES 4.7K OHM 1% 1/10W 0603)
R55#1  Resistance: 47k  Power Rating: 1/10W  [RES, 0603]  (hidden comment: RES 47K OHM 1% 1/10W 0603)
R56#1  Resistance (Ohms): 4.7k  Power (Watts): 1/10W  [RES, 0603]  (hidden comment: RES 4.7K OHM 1% 1/10W 0603)
R57#1  Resistance: 10k  Power: 1/10W  [RES, 0603]  (hidden comment: RES 10K OHM 1% 1/10W 0603)
R58#1  Resistance (Ohms): 4.7k  Power (Watts): 1/10W  [RES, 0603]  (hidden comment: RES 4.7K OHM 1% 1/10W 0603)
R59#1  Resistance (Ohms): 4.7k  Power (Watts): 1/10W  [RES, 0603]  (hidden comment: RES 4.7K OHM 1% 1/10W 0603)
R60#1  Power (Watts): 0.1W, 1/10W  Values: 47  [RES, 0603]  (hidden comment: RES SMD 47 OHM 1% 1/10W 0603)
R61#1  Resistance: 1.21k  Power: 1/10W  [RES, 0603]  (hidden comment: RES 1.21K OHM 1% 1/10W 0603)
U1#2  Manufacturer Part Number: BTS70081EPPXUMA1CT-ND  [IC LOAD SWITCH PG-TSDSO-14-22]  (hidden comment: IC LOAD SWITCH BTS70081EPPXUMA1)
U6  Manufacturer Part Number: BTS72002EPAXUMA1  [IC LOAD SWITCH PG-TSDSO-14-22]  (hidden comment: IC LOAD SWITCH BTS7200-2EPA PG-TSDSO-14_1)
U7#1  IC LOAD SWITCH BTS70401EPA PG-TSDSO-14-22  [IC LOAD SWITCH PG-TSDSO-14-22]  (value not drawn)

### Ports
HORN_EN (bidir), HORN_IS (out), PEDAL_EN (bidir), SPEAKER_EN (bidir), SPEAKER_IS (out), STEERING_EN (bidir), STR_PDL_DSEL (bidir), STR_PDL_IS (out)

### Nets
3V3: R23#1.2 R34.1 R54#1.1
GND: C2#2.2 C11#1.2 C12#1.2 C13#1.2 C14#1.2 C16.2 C22.2 C29#1.2 C30#1.2 C31#1.2 D1#1.1(A) D3.1(A) D4.1(A) P5.4 P5.5 P5.6 P6.3 P6.4 R24#1.2 R25#1.2 R26#1.2 R30.2 R31.2 R32.2 R44.2 R45.2 R52#1.2 R53#1.2 R55#1.2 R57#1.2 R60#1.2 R61#1.2
VBAT: C11#1.1 C12#1.1 C29#1.1 U1#2.15(VS) U6.15(VS) U7#1.15(VS)
Horns_PWR: C22.1 LED7.1(A) P6.1 P6.2 R44.1 U1#2.8(OUT) U1#2.9(OUT) U1#2.10(OUT) U1#2.12(OUT) U1#2.13(OUT) U1#2.14(OUT)
Pedal_PWR: C13#1.1 LED9#1.1(A) P5.2 R24#1.1 U6.12(OUT0) U6.13(OUT0) U6.14(OUT0)
Speaker_PWR: C30#1.1 LED2#1.1(A) P5.3 R55#1.1 U7#1.12(OUT0) U7#1.13(OUT0) U7#1.14(OUT0)
Steering_PWR: C14#1.1 LED8.1(A) P5.1 R26#1.1 U6.8(OUT1) U6.9(OUT1) U6.10(OUT1)
NetC2#2_1: C2#2.1 R51.1 ; port HORN_IS
NetC16_1: C16.1 R29.1 ; port STR_PDL_IS
NetC31#1_1: C31#1.1 R59#1.1 ; port SPEAKER_IS
NetD1#1_2: D1#1.2(K) R50.1 R51.2
NetD3_2: D3.2(K) R28.1 R29.2
NetD4_2: D4.2(K) R58#1.1 R59#1.2
NetLED2#1_2: LED2#1.2(K) R57#1.1
NetLED7_2: LED7.2(K) R25#1.1
NetLED8_2: LED8.2(K) R30.1
NetLED9#1_2: LED9#1.2(K) R31.1
NetR23#1_1: R23#1.1 ; port PEDAL_EN
NetR23#1_3: R23#1.3 ; port STR_PDL_DSEL
NetR23#1_4: R23#1.4 ; port STEERING_EN
NetR23#1_5: R23#1.5 U6.6(IN1)
NetR23#1_6: R23#1.6 U6.5(DSEL)
NetR23#1_7: R23#1.7 U6.3(DEN)
NetR23#1_8: R23#1.8 U6.2(IN0)
NetR28_2: R28.2 R32.1 U6.4(IS)
NetR34_2: R34.2 U1#2.3(DEN)
NetR38_1: R38.1 ; port HORN_EN
NetR38_2: R38.2 U1#2.2(IN)
NetR45_1: R45.1 U1#2.1(GND)
NetR50_2: R50.2 R52#1.1 U1#2.4(IS)
NetR53#1_1: R53#1.1 U6.1(GND)
NetR54#1_2: R54#1.2 U7#1.3(DEN)
NetR56#1_1: R56#1.1 ; port SPEAKER_EN
NetR56#1_2: R56#1.2 U7#1.2(IN)
NetR58#1_2: R58#1.2 R61#1.1 U7#1.4(IS)
NetR60#1_1: R60#1.1 U7#1.1(GND)

### Layout directives
mark named 1.2A: Pedal_PWR, Steering_PWR

### Notes on the sheet
- MAX Current 11.5A
- PROJECT
- DOCUMENT
- DRAWN BY
- LAST MODIFIED
- PART NUMBER
- REVISION
- SHEET
- VARIANT
- OF
- Engineering 5 - 1002
  University of Waterloo
  (519) 888-4567 x32978
  hardware@uwmidsun.com

### Library data of the parts
C2#2 C16 C31#1 = CAP CER 220PF 50V C0G/NP0 0603: 220pF ±5% 50V Ceramic Capacitor C0G, NP0 0603 (1608 Metric); Manufacturer: KEMET; Manufacturer Part Number: C0603C221J5GACAUTO; Dissipation Factor: 0.1%; Supplier 1: Digi-Key; Supplier Part Number 1: 399-6868-1-ND; Stock 1: 35170; Pricing 1: 1=0.14000, 10=0.09700, 100=0.04550, 500=0.03188, 1000=0.02640 (USD); RoHS: Yes; Mount: Surface Mount; Case/Package: 0603; Case Code (Metric): 1608; Case Code (Imperial): 0603; Contact Plating: Tin; Dielectric Material: Ceramic; Min Operating Temperature: -55°C; Max Operating Temperature: 125°C; Tolerance: 5%; Packaging: Tape and Reel; Package Quantity: 1; Voltage Rating (DC): 50V; Termination: SMD/SMT; Length: 1.6mm; Height: 0.8mm; Width: 0.031inch; Thickness: 0.034inch; Depth: 0.8mm; Ratings: AEC-Q200; Radiation Hardening: No; REACH SVHC: No SVHC; Lead Free: Lead Free; ComponentLink1URL: https://datasheet.ciiva.com/18192/getdatasheetpartid-416741-18192869.pdf?src-supplier=Verical; ComponentLink1Description: https://datasheet.ciiva.com/18192/getdatasheetpartid-416741-18192869.pdf?src-supplier=Verical; ComponentLink2URL: https://datasheet.ciiva.com/22694/1633156-22694015.pdf?src-supplier=Element14; ComponentLink2Description: https://datasheet.ciiva.com/22694/1633156-22694015.pdf?src-supplier=Element14; Dielectric: C0G
C11#1 C12#1 C29#1 = CAP CER 0.1UF 50V 10% X7R 0603: as C1 on sheet Controller_Board_Interface; Supplier 1: Digi-Key; Supplier Part Number 1: 478-5052-1-ND; Packaging: Cut Tape (CT); Part Status: Active; Operating Temperature: -55°C ~ 125°C; Ratings: -; Mounting Type: Surface Mount, MLCC; Package / Case: 0603 (1608 Metric); Size / Dimension: 0.063" L x 0.032" W (1.60mm x 0.81mm); Height - Seated (Max): -; Thickness (Max): 0.035" (0.90mm); Lead Spacing: -; Lead Style: -; ComponentLink1URL: http://datasheets.avx.com/X7RDielectric.pdf; ComponentLink1Description: http://datasheets.avx.com/X7RDielectric.pdf; Tolerance: ±10%
C13#1 C14#1 C22 C30#1 = CAP CER 10nF 50V 5% X7R 0603: 10000pF ±5% 50V Ceramic Capacitor U2J 0603 (1608 Metric); Manufacturer 1: KEMET; Manufacturer Part Number 1: C0603C103J5JAC7867; Supplier 1: Digi-Key; Supplier Part Number 1: 399-13384-1-ND; Packaging: Cut Tape (CT); Part Status: Active; Operating Temperature: -55°C ~ 125°C; Ratings: -; Failure Rate: -; Mounting Type: Surface Mount, MLCC; Package / Case: 0603 (1608 Metric); Size / Dimension: 0.063" L x 0.032" W (1.60mm x 0.80mm); Height - Seated (Max): -; Thickness (Max): 0.034" (0.87mm); Lead Spacing: -; Lead Style: -; ComponentLink1URL: http://www.kemet.com/docfinder?Partnumber=C0603C103J5JAC7867; ComponentLink1Description: http://www.kemet.com/docfinder?Partnumber=C0603C103J5JAC7867; Tolerance: ±5%
D1#1 D3 D4 = DIODE ZENER 3.3V 200MW SOD323: Zener Diode 3.3V 200mW ±5% Surface Mount SOD-323; ComponentLink1Description: http://www.vishay.com/docs/85764/bzx384.pdf; ComponentLink1URL: http://www.vishay.com/docs/85764/bzx384.pdf; Supplier 1: Digi-Key; Supplier Part Number 1: BZX384C3V3-E3-08GICT-ND
LED2#1 LED7 LED8 LED9#1 = LED YELLOW CLEAR 2.1V 0603: Yellow 590nm LED Indication - Discrete 2V 0603 (1608 Metric); Manufacturer: Wurth Electronics Inc.; Manufacturer Part Number: 150060YS75000; Lens Color: Colorless; Millicandela Rating: 120mcd; Lens Style/Size: Rectangle with Flat Top, 1.10mm x 0.70mm; Current - Test: 20mA; Viewing Angle: 140°; Wavelength - Peak: 595nm; Supplier 1: Digi-Key; RoHS: RoHS Compliant; Category: Optoelectronics; Stock 1: 10523; Pricing 1: 1=0.21, 100=0.1617, 500=0.13964 (CAD); Packaging: Cut Tape (CT); Part Status: Active; Lens Transparency: Clear; Mounting Type: Surface Mount; Wavelength - Dominant: 590nm; Features: -; Package / Case: 0603 (1608 Metric); Supplier Device Package: 0603; Size / Dimension: 1.60mm L x 0.80mm W; Height (Max): 0.80mm; ComponentLink1URL: http://katalog.we-online.de/led/datasheet/150060YS75000.pdf; ComponentLink1Description: http://katalog.we-online.de/led/datasheet/150060YS75000.pdf; Supplier Part Number 1: 732-4981-1-ND
P5 = CONN 6POS MICRO-FIT 3mm: Connector Header Through Hole 6 position 0.118" (3.00mm); ComponentLink1Description: http://www.literature.molex.com/SQLImages/kelmscott/Molex/PDF_Images/987650-5984.pdf; ComponentLink1URL: http://www.literature.molex.com/SQLImages/kelmscott/Molex/PDF_Images/987650-5984.pdf; ComponentLink2Description: https://www.molex.com/pdm_docs/ps/PS-43045.pdf; ComponentLink2URL: https://www.molex.com/pdm_docs/ps/PS-43045.pdf; ComponentLink3Description: https://www.molex.com/pdm_docs/sd/430450627_sd.pdf; ComponentLink3URL: https://www.molex.com/pdm_docs/sd/430450627_sd.pdf; Supplier 1: Digi-Key
P6 = CONN 4POS MICRO-FIT 3mm: Micro-Fit 3.0 Vertical Header, 3.00mm Pitch, Dual Row, 4 Circuits, with PCB Polarizing Peg, Tin, Glow-Wire Capable, Black; Manufacturer: Molex, LLC; Manufacturer Part Number: 430450427; Pitch - Mating: 0.118" (3.00mm); Number of Positions: 6; Number of Positions Loaded: All; Style: Board to Cable/Wire; Shrouding: Shrouded - 4 Wall; Contact Length - Post: 0.125" (3.18mm); Material Flammability Rating: UL94 V-0; Contact Resistance: 10mR; Number of Contacts: 4; Number of Ports: 1; Row Spacing: 0.118inch; RoHS: RoHS Compliant; Category: Connectors, Interconnects; Packaging: Tray; Part Status: Active; Connector Type: Header; Contact Type: Male Pin; Number of Rows: 2; Row Spacing - Mating: 0.118" (3.00mm); Mounting Type: Through Hole; Termination: Solder; Fastening Type: Locking Ramp; Contact Length - Mating: -; Overall Contact Length: -; Insulation Height: 0.390" (9.91mm); Contact Shape: Square; Contact Finish - Mating: Tin; Contact Finish Thickness - Mating: 60.0µin (1.52µm); Contact Finish - Post: Tin; Contact Material: Brass; Insulation Material: Liquid Crystal Polymer (LCP), Glass Filled; Features: Board Guide; Operating Temperature: -; Ingress Protection: -; Insulation Color: Black; Current Rating: -; Voltage Rating: -; Mated Stacking Heights: -; Contact Finish Thickness - Post: -; Applications: General Purpose, Medical, Military, Telecommunications; Mount: Through Hole; Contact Plating: Tin; Housing Material: Polymer; Color: Black; Number of Terminals: 4; Housing Color: Black; Min Operating Temperature: -40°C; Max Operating Temperature: 105°C; Package Quantity: 2232; Orientation: Straight; Length: 10.15mm; Pitch: 3mm; Depth: 8.77mm; ComponentLink4URL: http://www.molex.com/webdocs/datasheets/pdf/en-us/0430450427_PCB_HEADERS.pdf; ComponentLink4Description: http://www.molex.com/webdocs/datasheets/pdf/en-us/0430450427_PCB_HEADERS.pdf; Supplier 1: Digi-Key
R23#1 = RES ARRAY 4 RES 4.7K OHM 1206: 4.7k Ohm ±5% 62.5mW Power Per Element Isolated 4 Resistor Network/Array ±200ppm/°C 1206 (3216 Metric), Convex, Long Side Terminals; Number of Resistors: 4; Applications Automotive: AEC-Q200; Applications: -; Category: Resistors; Circuit Type: Isolated; Part Status: Active; Resistance (Ohms): 4.7k; Tolerance: ±5%; Power Per Element: 62.5mW; Number of Pins: 8; Operating Temperature: -55°C ~ 125°C; Mounting Type: Surface Mount; Package / Case: 1206 (3216 Metric), Convex, Long Side Terminals; Supplier Device Package: 1206; Size / Dimension: 0.126" L x 0.063" W (3.20mm x 1.60mm); Height - Seated (Max): 0.024" (0.60mm); Packaging: Cut Tape (CT); Resistor Matching Ratio: -; Resistor-Ratio-Drift: -; Series: EXB; ComponentLink1Description: https://industrial.panasonic.com/cdbs/www-data/pdf/AOC0000/AOC0000C14.pdf; ComponentLink1URL: https://industrial.panasonic.com/cdbs/www-data/pdf/AOC0000/AOC0000C14.pdf; Supplier 1: Digi-Key; Temperature Coefficient: ±200ppm/°C
R24#1 R26#1 R44 R55#1 = RES 47K OHM 1% 1/10W 0603: 47 kOhms ±1% 0.1W, 1/10W Chip Resistor 0603 (1608 Metric) Automotive AEC-Q200 Thick Film; Manufacturer: Panasonic; Manufacturer Part Number: ERJ3EKF4702V; Voltage Rating: 75V; Temperature Coefficient: 100ppm/°C; Working Voltage: 6V; Max Power Dissipation: 100mW; ComponentLink1URL: https://industrial.panasonic.com/cdbs/www-data/pdf/RDO0000/AOA0000C291.pdf; ComponentLink1Description: https://industrial.panasonic.com/cdbs/www-data/pdf/RDO0000/AOA0000C291.pdf; ComponentLink2URL: https://datasheet.ciiva.com/6138/aoa0000ce2-6138149.pdf?src-supplier=Farnell; ComponentLink2Description: https://datasheet.ciiva.com/6138/aoa0000ce2-6138149.pdf?src-supplier=Farnell; ComponentLink3URL: https://datasheet.ciiva.com/7802/aoa0000ce2-7802421.pdf?src-supplier=Element14; ComponentLink3Description: https://datasheet.ciiva.com/7802/aoa0000ce2-7802421.pdf?src-supplier=Element14; ComponentLink4URL: https://datasheet.ciiva.com/48531/aoa0000ce2-48531029.pdf?src-supplier=Avnet; ComponentLink4Description: https://datasheet.ciiva.com/48531/aoa0000ce2-48531029.pdf?src-supplier=Avnet; ComponentLink5URL: https://datasheet.ciiva.com/16514/aoa0000ce2-16514071.pdf?src-supplier=Avnet+Asia; ComponentLink5Description: https://datasheet.ciiva.com/16514/aoa0000ce2-16514071.pdf?src-supplier=Avnet+Asia; ComponentLink6URL: https://datasheet.ciiva.com/46398/1678782-46398088.pdf?src-supplier=Element14; ComponentLink6Description: https://datasheet.ciiva.com/46398/1678782-46398088.pdf?src-supplier=Element14; ComponentLink7URL: https://datasheet.ciiva.com/24069/aoa0000ce2-24069209.pdf?src-supplier=Mouser; ComponentLink7Description: https://datasheet.ciiva.com/24069/aoa0000ce2-24069209.pdf?src-supplier=Mouser; ComponentLink8URL: https://datasheet.ciiva.com/46398/1678782-46398089.pdf?src-supplier=Element14; ComponentLink8Description: https://datasheet.ciiva.com/46398/1678782-46398089.pdf?src-supplier=Element14; ComponentLink9URL: https://datasheet.ciiva.com/30236/aoa0000ce2-30236698.pdf?src-supplier=Onlinecomponents.com; ComponentLink9Description: https://datasheet.ciiva.com/30236/aoa0000ce2-30236698.pdf?src-supplier=Onlinecomponents.com; ComponentLink10URL: https://datasheet.ciiva.com/22722/426256-22722781.pdf?src-supplier=Element14; ComponentLink10Description: https://datasheet.ciiva.com/22722/426256-22722781.pdf?src-supplier=Element14; ComponentLink11URL: https://datasheet.ciiva.com/16758/70260748-16758831.pdf?src-supplier=Allied+Electronics; ComponentLink11Description: https://datasheet.ciiva.com/16758/70260748-16758831.pdf?src-supplier=Allied+Electronics; Supplier 1: Digi-Key; Stock 1: 1704740; Pricing 1: 1 = 0.100000, 10 = 0.065000, 100 = 0.026400, 1000 = 0.011860, 2500 = 0.010290 (USD); RoHS: Yes; Mount: Surface Mount; Case/Package: 0603; Number of Pins: 2; Case Code (Metric): 1608; Case Code (Imperial): 0603; Contact Plating: Tin; Min Operating Temperature: -55°C; Max Operating Temperature: 155°C; Tolerance: 1%; Packaging: Tape and Reel; Package Quantity: 1; Composition: Thick Film; Number of Terminations: 2; Termination: SMD/SMT; Military Standard: Not; Voltage Rating (DC): 75V; Features: Automotive AEC-Q200; Length: 1.6mm; Height: 0.022inch; Width: 0.031inch; Depth: 0.8mm; Radiation Hardening: No; REACH SVHC: No SVHC; Lead Free: Lead Free; Supplier Part Number 1: P47.0KHCT-ND
R25#1 R30 R31 R57#1 = RES 10K OHM 1% 1/10W 0603: as R4 on sheet Controller_Board_Interface; Supplier 1: Digi-Key; Supplier Part Number 1: 311-10.0KHRCT-ND; Packaging: Cut Tape (CT); Part Status: Active; Composition: Thick Film; Operating Temperature: -55°C ~ 155°C; Package / Case: 0603 (1608 Metric); Supplier Device Package: 0603; Size / Dimension: 0.063" L x 0.031" W (1.60mm x 0.80mm); Height - Seated (Max): 0.022" (0.55mm); Failure Rate: -; ComponentLink1URL: http://www.yageo.com/documents/recent/PYu-RC_Group_51_RoHS_L_7.pdf; ComponentLink1Description: http://www.yageo.com/documents/recent/PYu-RC_Group_51_RoHS_L_7.pdf; Tolerance: ±1%
R28 R29 R34 R38 R50 R51 R54#1 R56#1 R58#1 R59#1 = RES 4.7K OHM 1% 1/10W 0603: as R7 on sheet Controller_Board_Interface; Supplier 1: Digi-Key; Supplier Part Number 1: 311-4.70KHRCT-ND; RoHS: RoHS Compliant; Category: Resistors; Stock 1: 3487566; Pricing 1: 1=0.16, 10=0.022, 100=0.0089, 1000=0.00402, 2500=0.00349 (CAD); Packaging: Cut Tape (CT); Part Status: Active; Composition: Thick Film; Features: Moisture Resistant; Operating Temperature: -55°C ~ 155°C; Package / Case: 0603 (1608 Metric); Supplier Device Package: 0603; Size / Dimension: 0.063" L x 0.031" W (1.60mm x 0.80mm); Height - Seated (Max): 0.022" (0.55mm); Failure Rate: -; ComponentLink1URL: http://www.yageo.com/documents/recent/PYu-RC_Group_51_RoHS_L_7.pdf; ComponentLink1Description: http://www.yageo.com/documents/recent/PYu-RC_Group_51_RoHS_L_7.pdf; Tolerance: ±1%
R32 R52#1 R61#1 = RES 1.21K OHM 1% 1/10W 0603: 1.21k Ohm ±1% 0.1W, 1/10W Chip Resistor 0603 (1608 Metric) Moisture Resistant Thick Film; Manufacturer 1: Yageo; Manufacturer Part Number 1: RC0603FR-071K21L; Temperature Coefficient: ±100ppm/°C; Supplier 1: Digi-Key; Supplier Part Number 1: 311-1.21KHRCT-ND; Packaging: Cut Tape (CT); Part Status: Active; Composition: Thick Film; Operating Temperature: -55°C ~ 155°C; Package / Case: 0603 (1608 Metric); Supplier Device Package: 0603; Size / Dimension: 0.063" L x 0.031" W (1.60mm x 0.80mm); Height - Seated (Max): 0.022" (0.55mm); Failure Rate: -; ComponentLink1URL: http://www.yageo.com/documents/recent/PYu-RC_Group_51_RoHS_L_7.pdf; ComponentLink1Description: http://www.yageo.com/documents/recent/PYu-RC_Group_51_RoHS_L_7.pdf; Tolerance: ±1%
R45 R53#1 R60#1 = RES SMD 47 OHM 1% 1/10W 0603: 47 Ohms ±1% 0.1W, 1/10W Chip Resistor 0603 (1608 Metric) Automotive AEC-Q200, Moisture Resistant Thick Film; Temperature Coefficient: ±100ppm/°C; Resistance: 47 Ohms; Operating Temperature: -55°C ~ 155°C; Features: Automotive AEC-Q200, Moisture Resistant; Tolerance: ±1%; Composition: Thick Film; Ratings: AEC-Q200; Package / Case: 0603 (1608 Metric); Number of Terminations: 2; Height - Seated (Max): 0.022" (0.55mm); Size / Dimension: 0.063" L x 0.031" W (1.60mm x 0.80mm); ComponentLink1Description: https://www.yageo.com/upload/media/product/productsearch/datasheet/rchip/PYu-AC_51_RoHS_L_7.pdf; ComponentLink1URL: https://www.yageo.com/upload/media/product/productsearch/datasheet/rchip/PYu-AC_51_RoHS_L_7.pdf; Supplier 1: Digi-Key; Supplier Part Number 1: 311-47LDCT-ND; Supplier Device Package: 0603
U1#2 = IC LOAD SWITCH BTS70081EPPXUMA1: Power Switch/Driver 1:1 N-Channel 11A PG-TSDSO-14-22; Manufacturer: Infineon; RoHS: YES; ComponentLink1Description: https://media.digikey.com/pdf/Data%20Sheets/Infineon%20PDFs/BTS7008-1EPP_v1.03_4-29-19.pdf; ComponentLink1URL: https://media.digikey.com/pdf/Data%20Sheets/Infineon%20PDFs/BTS7008-1EPP_v1.03_4-29-19.pdf; Supplier 1: Digi-Key; Supplier Part Number 1: BTS70081EPPXUMA1CT-ND
U6 = IC LOAD SWITCH BTS7200-2EPA PG-TSDSO-14_1: Power Switch/Driver 1:1 N-Channel 1.2A PG-TSDSO-14-22; Manufacturer: Infineon; Supplier 1: Digi-Key; Supplier Part Number 1: BTS72002EPAXUMA1CT-ND; Stock 1: 1973; Pricing 1: 1=1.31000, 10=1.17500, 100=0.91640, 500=0.75700, 1000=0.59763 (USD); RoHS: No; ComponentLink1Description: https://www.infineon.com/dgdl/Infineon-BTS7200-2EPA-DS-v01_00-EN.pdf?fileId=5546d462636cc8fb016421e548a61215; ComponentLink1URL: https://www.infineon.com/dgdl/Infineon-BTS7200-2EPA-DS-v01_00-EN.pdf?fileId=5546d462636cc8fb016421e548a61215
U7#1 = IC LOAD SWITCH BTS70401EPA PG-TSDSO-14-22: Power Switch/Driver 1:1 N-Channel 4.5A PG-TSDSO-14-22; Manufacturer: Infineon; Manufacturer Part Number: BTS70401EPAXUMA1; ComponentLink1Description: https://www.infineon.com/dgdl/Infineon-BTS7040-1EPA-DS-v01_00-EN.pdf?fileId=5546d462636cc8fb0163fe8f965308bc; ComponentLink1URL: https://www.infineon.com/dgdl/Infineon-BTS7040-1EPA-DS-v01_00-EN.pdf?fileId=5546d462636cc8fb0163fe8f965308bc; Supplier 1: Digi-Key; Supplier Part Number 1: BTS70401EPAXUMA1CT-ND